# Altium schematic sheet L0.SchDoc
size A4
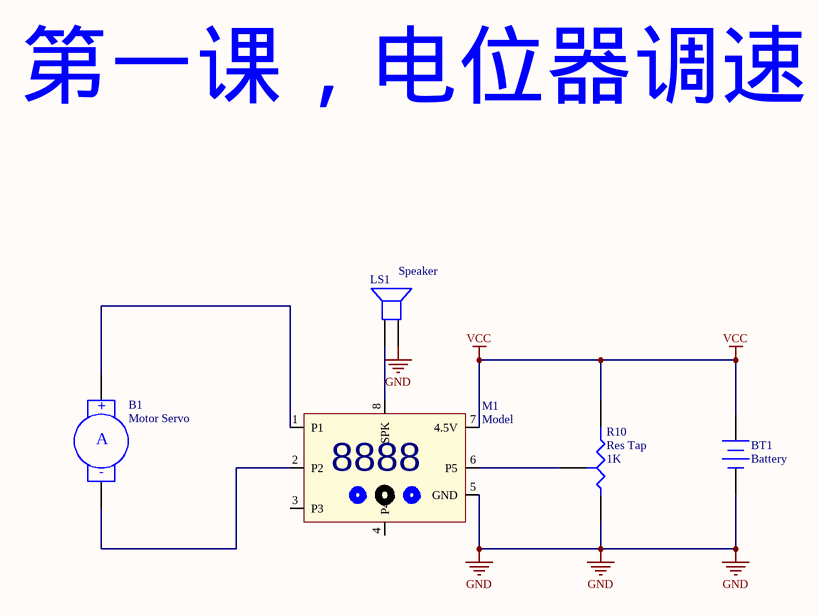
[diagram p0: L0.SchDoc]

## Parts
B1  Motor Servo  [RAD-0.4]
BT1  Battery  [BAT-2]
LS1  Speaker  [PIN2]
M1  Model
R10  Res Tap  value 1K  [VR3]

## Nets
GND: BT1.2(-) LS1.2 M1.5(GND) R10.1(A)
VCC: BT1.1(+) M1.7(4.5V) R10.2(B)
NetB1_1: B1.1(+) M1.1(P1)
NetB1_2: B1.2(-) M1.2(P2)
NetLS1_1: LS1.1 M1.8(SPK)
NetM1_6: M1.6(P5) R10.3(TAP)

Not connected (* = marked no-connect by the designer): M1 3(P3) 4(P4)

## Notes on the sheet
- Labels drawn without touching a wire or pin: 第一课，电位器调速
- (in symbol M?) 8888
- (in symbol Motor Servo) A

## Library data of the parts
B1 = Motor Servo: Servo Motor; Published: 24-Mar-1999; LatestRevisionDate: 17-Jul-2002; LatestRevisionNote: Re-released for DXP Platform.; PackageReference: RAD-0.4; Publisher: Altium Limited; PackageDescription: Radial Cap, Thru-Hole; 2 Leads; 0.4 in Pin Spacing
BT1 = Battery: Multicell Battery; Published: 24-Mar-1999; LatestRevisionDate: 17-Jul-2002; LatestRevisionNote: Re-released for DXP Platform.; PackageReference: BAT-2; Publisher: Altium Limited; PackageDescription: Battery; 2 Leads
LS1 = Speaker: Loudspeaker; Published: 24-Mar-1999; LatestRevisionDate: 17-Jul-2002; LatestRevisionNote: Re-released for DXP Platform.; PackageReference: PIN2; Publisher: Altium Limited
M1 = M?: 积木模块
R10 = Res Tap: Tapped Resistor; Sim Note: Enter the Resistance value and the set point into parameter fields.; Set Position: 0.5; Published: 24-Mar-1999; LatestRevisionDate: 17-Jul-2002; LatestRevisionNote: Re-released for DXP Platform.; PackageReference: VR3; Publisher: Altium Limited; PackageDescription: Variable Resistor, Thru-Hole; 3 Leads